# Altium schematic sheet header.schdoc: HEADER
size A4; Date: 10.05.2026; CheckedBy: BCY; DrawnBy: miaow; Revision: v1.0.0; SheetNumber: 17; SheetTotal: 18; BoardType: MAIN_PCB; Desc: 40-pin header
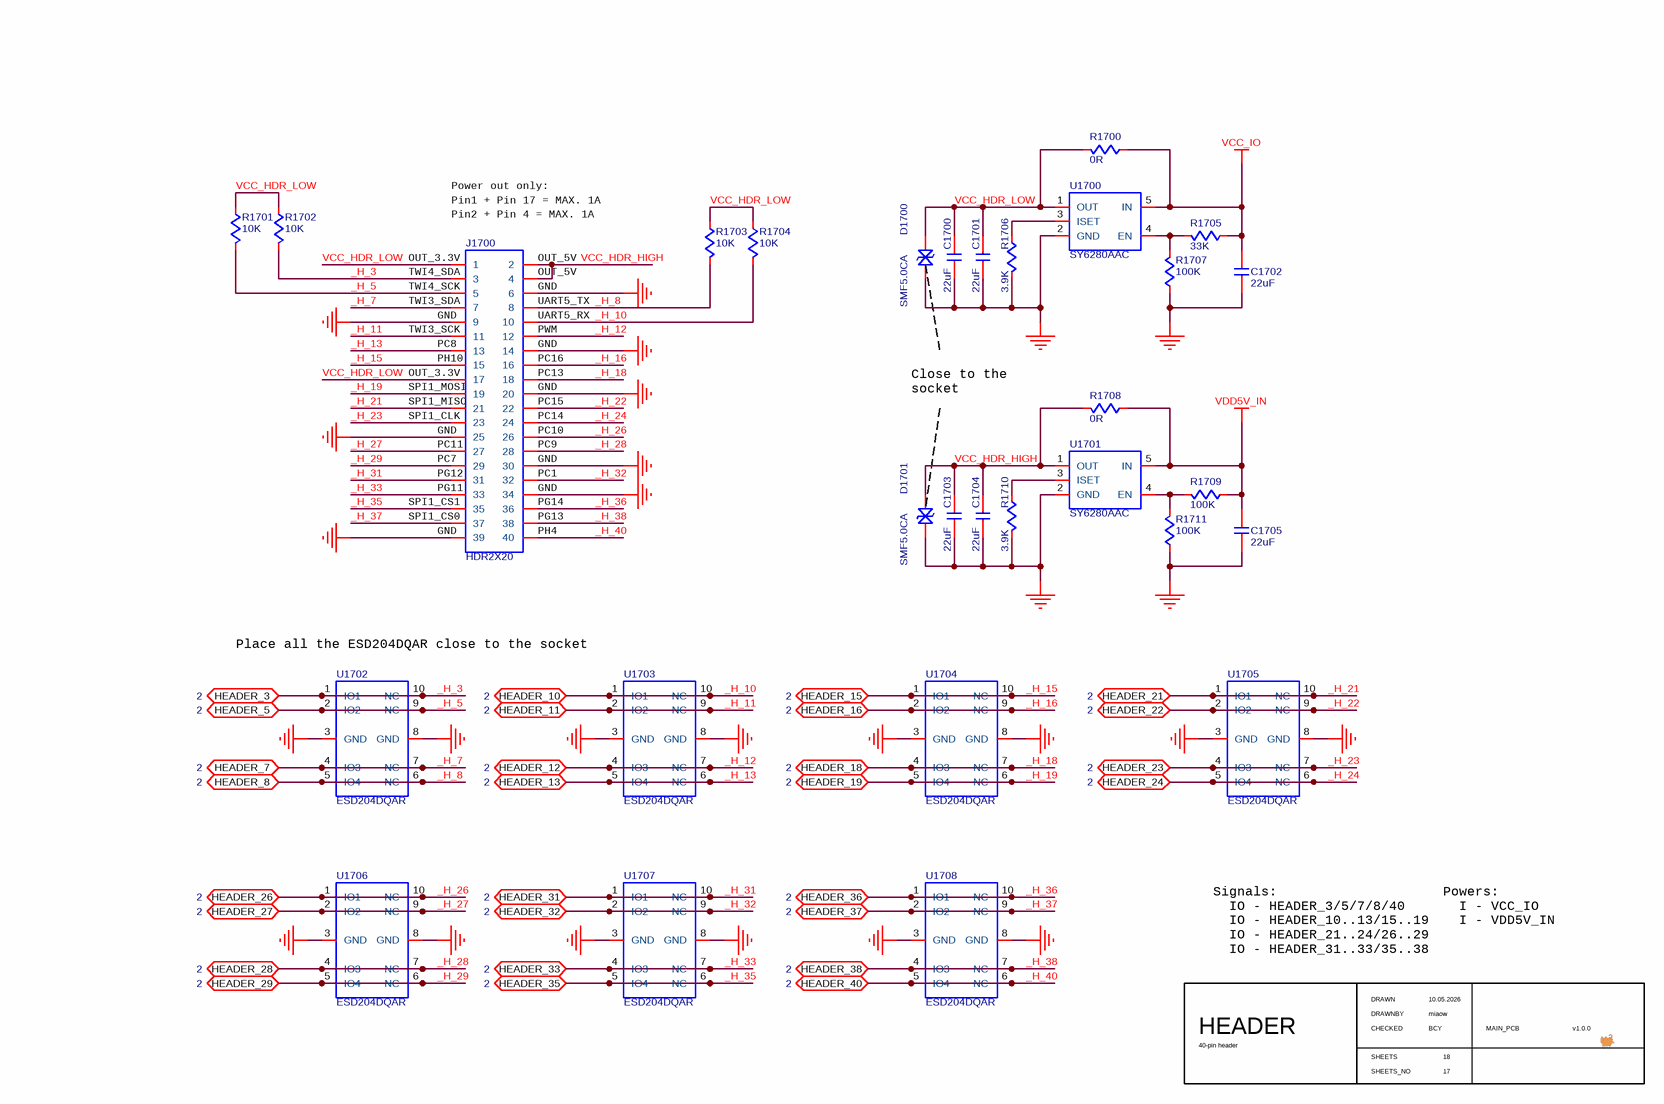
[diagram p0: header.schdoc]

## Parts
C1700  value 22uF  [C0603]  (hidden comment: C-NOMO)
C1701  value 22uF  [C0603]  (hidden comment: C-NOMO)
C1702  value 22uF  [C0603]  (hidden comment: C-NOMO)
C1703  value 22uF  [C0603]  (hidden comment: C-NOMO)
C1704  value 22uF  [C0603]  (hidden comment: C-NOMO)
C1705  value 22uF  [C0603]  (hidden comment: C-NOMO)
D1700  SMF5.0CA  [SMF5.0CA]
D1701  SMF5.0CA  [SMF5.0CA]
J1700  HDR2X20  [HDR2X20]
R1700  value 0R  [R1206]  (hidden comment: R)
R1701  value 10K  [R0402]  (hidden comment: R)
R1702  value 10K  [R0402]  (hidden comment: R)
R1703  value 10K  [R0402]  (hidden comment: R)
R1704  value 10K  [R0402]  (hidden comment: R)
R1705  value 33K  [R0402]  (hidden comment: R)
R1706  value 3.9K  [R0402]  (hidden comment: R)
R1707  value 100K  [R0402]  (hidden comment: R)
R1708  value 0R  [R1206]  (hidden comment: R)
R1709  value 100K  [R0402]  (hidden comment: R)
R1710  value 3.9K  [R0402]  (hidden comment: R)
R1711  value 100K  [R0402]  (hidden comment: R)
U1700  SY6280AAC  [SY6280AAC]
U1701  SY6280AAC  [SY6280AAC]
U1702  ESD204DQAR  [ESD204DQAR]
U1703  ESD204DQAR  [ESD204DQAR]
U1704  ESD204DQAR  [ESD204DQAR]
U1705  ESD204DQAR  [ESD204DQAR]
U1706  ESD204DQAR  [ESD204DQAR]
U1707  ESD204DQAR  [ESD204DQAR]
U1708  ESD204DQAR  [ESD204DQAR]

## Ports
HEADER_3 (bidir, see 2), HEADER_5 (bidir, see 2), HEADER_7 (bidir, see 2), HEADER_8 (bidir, see 2), HEADER_10 (bidir, see 2), HEADER_11 (bidir, see 2), HEADER_12 (bidir, see 2), HEADER_13 (bidir, see 2), HEADER_15 (bidir, see 2), HEADER_16 (bidir, see 2), HEADER_18 (bidir, see 2), HEADER_19 (bidir, see 2), HEADER_21 (bidir, see 2), HEADER_22 (bidir, see 2), HEADER_23 (bidir, see 2), HEADER_24 (bidir, see 2), HEADER_26 (bidir, see 2), HEADER_27 (bidir, see 2), HEADER_28 (bidir, see 2), HEADER_29 (bidir, see 2), HEADER_31 (bidir, see 2), HEADER_32 (bidir, see 2), HEADER_33 (bidir, see 2), HEADER_35 (bidir, see 2), HEADER_36 (bidir, see 2), HEADER_37 (bidir, see 2), HEADER_38 (bidir, see 2), HEADER_40 (bidir, see 2)

## Nets
GND: C1700.1 C1701.1 C1702.2 C1703.1 C1704.1 C1705.1 D1700.1 D1701.1 J1700.6 J1700.9 J1700.14 J1700.20 J1700.25 J1700.30 J1700.34 J1700.39 R1706.1 R1707.2 R1710.1 R1711.2 U1700.2(GND) U1701.2(GND) U1702.3(GND) U1702.8(GND) U1703.3(GND) U1703.8(GND) U1704.3(GND) U1704.8(GND) U1705.3(GND) U1705.8(GND) U1706.3(GND) U1706.8(GND) U1707.3(GND) U1707.8(GND) U1708.3(GND) U1708.8(GND)
VCC_IO: C1702.1 R1700.2 R1705.2 U1700.5(IN)
VDD5V_IN: C1705.2 R1708.2 R1709.2 U1701.5(IN)
_H_3: J1700.3 R1702.1 U1702.1(IO1) U1702.10(NC) ; port HEADER_3
_H_5: J1700.5 R1701.1 U1702.2(IO2) U1702.9(NC) ; port HEADER_5
_H_7: J1700.7 U1702.4(IO3) U1702.7(NC) ; port HEADER_7
_H_8: J1700.8 R1703.1 U1702.5(IO4) U1702.6(NC) ; port HEADER_8
_H_10: J1700.10 R1704.1 U1703.1(IO1) U1703.10(NC) ; port HEADER_10
_H_11: J1700.11 U1703.2(IO2) U1703.9(NC) ; port HEADER_11
_H_12: J1700.12 U1703.4(IO3) U1703.7(NC) ; port HEADER_12
_H_13: J1700.13 U1703.5(IO4) U1703.6(NC) ; port HEADER_13
_H_15: J1700.15 U1704.1(IO1) U1704.10(NC) ; port HEADER_15
_H_16: J1700.16 U1704.2(IO2) U1704.9(NC) ; port HEADER_16
_H_18: J1700.18 U1704.4(IO3) U1704.7(NC) ; port HEADER_18
_H_19: J1700.19 U1704.5(IO4) U1704.6(NC) ; port HEADER_19
_H_21: J1700.21 U1705.1(IO1) U1705.10(NC) ; port HEADER_21
_H_22: J1700.22 U1705.2(IO2) U1705.9(NC) ; port HEADER_22
_H_23: J1700.23 U1705.4(IO3) U1705.7(NC) ; port HEADER_23
_H_24: J1700.24 U1705.5(IO4) U1705.6(NC) ; port HEADER_24
_H_26: J1700.26 U1706.1(IO1) U1706.10(NC) ; port HEADER_26
_H_27: J1700.27 U1706.2(IO2) U1706.9(NC) ; port HEADER_27
_H_28: J1700.28 U1706.4(IO3) U1706.7(NC) ; port HEADER_28
_H_29: J1700.29 U1706.5(IO4) U1706.6(NC) ; port HEADER_29
_H_31: J1700.31 U1707.1(IO1) U1707.10(NC) ; port HEADER_31
_H_32: J1700.32 U1707.2(IO2) U1707.9(NC) ; port HEADER_32
_H_33: J1700.33 U1707.4(IO3) U1707.7(NC) ; port HEADER_33
_H_35: J1700.35 U1707.5(IO4) U1707.6(NC) ; port HEADER_35
_H_36: J1700.36 U1708.1(IO1) U1708.10(NC) ; port HEADER_36
_H_37: J1700.37 U1708.2(IO2) U1708.9(NC) ; port HEADER_37
_H_38: J1700.38 U1708.4(IO3) U1708.7(NC) ; port HEADER_38
_H_40: J1700.40 U1708.5(IO4) U1708.6(NC) ; port HEADER_40
VCC_HDR_HIGH: C1703.2 C1704.2 D1701.2 J1700.2 J1700.4 R1708.1 U1701.1(OUT)
VCC_HDR_LOW: C1700.2 C1701.2 D1700.2 J1700.1 J1700.17 R1700.1 R1701.2 R1702.2 R1703.2 R1704.2 U1700.1(OUT)
NetR1705_1: R1705.1 R1707.1 U1700.4(EN)
NetR1706_2: R1706.2 U1700.3(ISET)
NetR1709_1: R1709.1 R1711.1 U1701.4(EN)
NetR1710_2: R1710.2 U1701.3(ISET)

## Notes on the sheet
- Power out only:
- (near J1700) OUT_3.3V
- Pin1 + Pin 17 = MAX. 1A
- (near J1700) Pin2 + Pin 4 = MAX. 1A
- (near J1700) OUT_5V
- (near J1700) TWI4_SDA
- (near J1700) TWI4_SCK
- (near J1700) TWI3_SDA
- (near J1700) TWI3_SCK
- (near J1700) GND
- (near J1700) UART5_TX
- (near J1700) UART5_RX
- (near J1700) PWM
- (near J1700) SPI1_MOSI
- (near J1700) SPI1_MISO
- (near J1700) PC8
- (near J1700) PH10
- (near J1700) PC16
- (near J1700) PC13
- (near J1700) PC15
- Close to the socket
- (near J1700) SPI1_CLK
- (near J1700) PC11
- (near J1700) PC7
- (near J1700) PG12
- (near J1700) PC14
- (near J1700) PC10
- (near J1700) PC9
- (near J1700) PC1
- (near J1700) SPI1_CS1
- (near J1700) SPI1_CS0
- (near J1700) PG11
- (near J1700) PG14
- (near J1700) PG13
- (near J1700) PH4
- (near U1702) Place all the ESD204DQAR close to the socket
- Signals:
  IO - HEADER_3/5/7/8/40
  IO - HEADER_10..13/15..19
  IO - HEADER_21..24/26..29
  IO - HEADER_31..33/35..38
- Powers:
  I - VCC_IO
  I - VDD5V_IN
- DRAWN
- CHECKED
- DRAWNBY
- SHEETS
- SHEETS_NO

## Library data of the parts
C1700-C1705 = C-NOMO: voltage: 10V; precision: 20%; Supplier 1: LCSC; Supplier Part Number 1: C2980159
D1700 D1701 = SMF5.0CA: TVS/ESD; Supplier 1: LCSC; Supplier Part Number 1: C19077498
R1700 R1708 = R: precision: 30mR; Supplier 1: LCSC; Supplier Part Number 1: C2907363
R1701-R1707 R1709-R1711 = R: precision: 1%; Supplier 1: LCSC
  R1701-R1704: Supplier Part Number 1: C25744
  R1705: Supplier Part Number 1: C25779
  R1706 R1710: Supplier Part Number 1: C51721
  R1707 R1709 R1711: Supplier Part Number 1: C25741
U1700 U1701 = SY6280AAC: PWR SWITCH; Supplier 1: LCSC; Supplier Part Number 1: C55136
U1702-U1708 = ESD204DQAR: TVS/ESD - 4 ch, 3.6V, 5V, 0.55pF@1MHz, 30KV; Supplier 1: LCSC; Supplier Part Number 1: C553132
J1700 = HDR2X20: Supplier 1: LCSC; Supplier Part Number 1: C124383